# EasyEDA Pro project 无感无刷stc-V2.eprj

# Schematic Schematic1
Board Name: Board1; Create Date: 2025-03-20; Page Name: P1; Project Name: 无感无刷stc-V2; Schematic Name: Schematic1; Update Date: 2025-06-07; Company: 嘉立创EDA; Page Size: A4; Version: V1.0
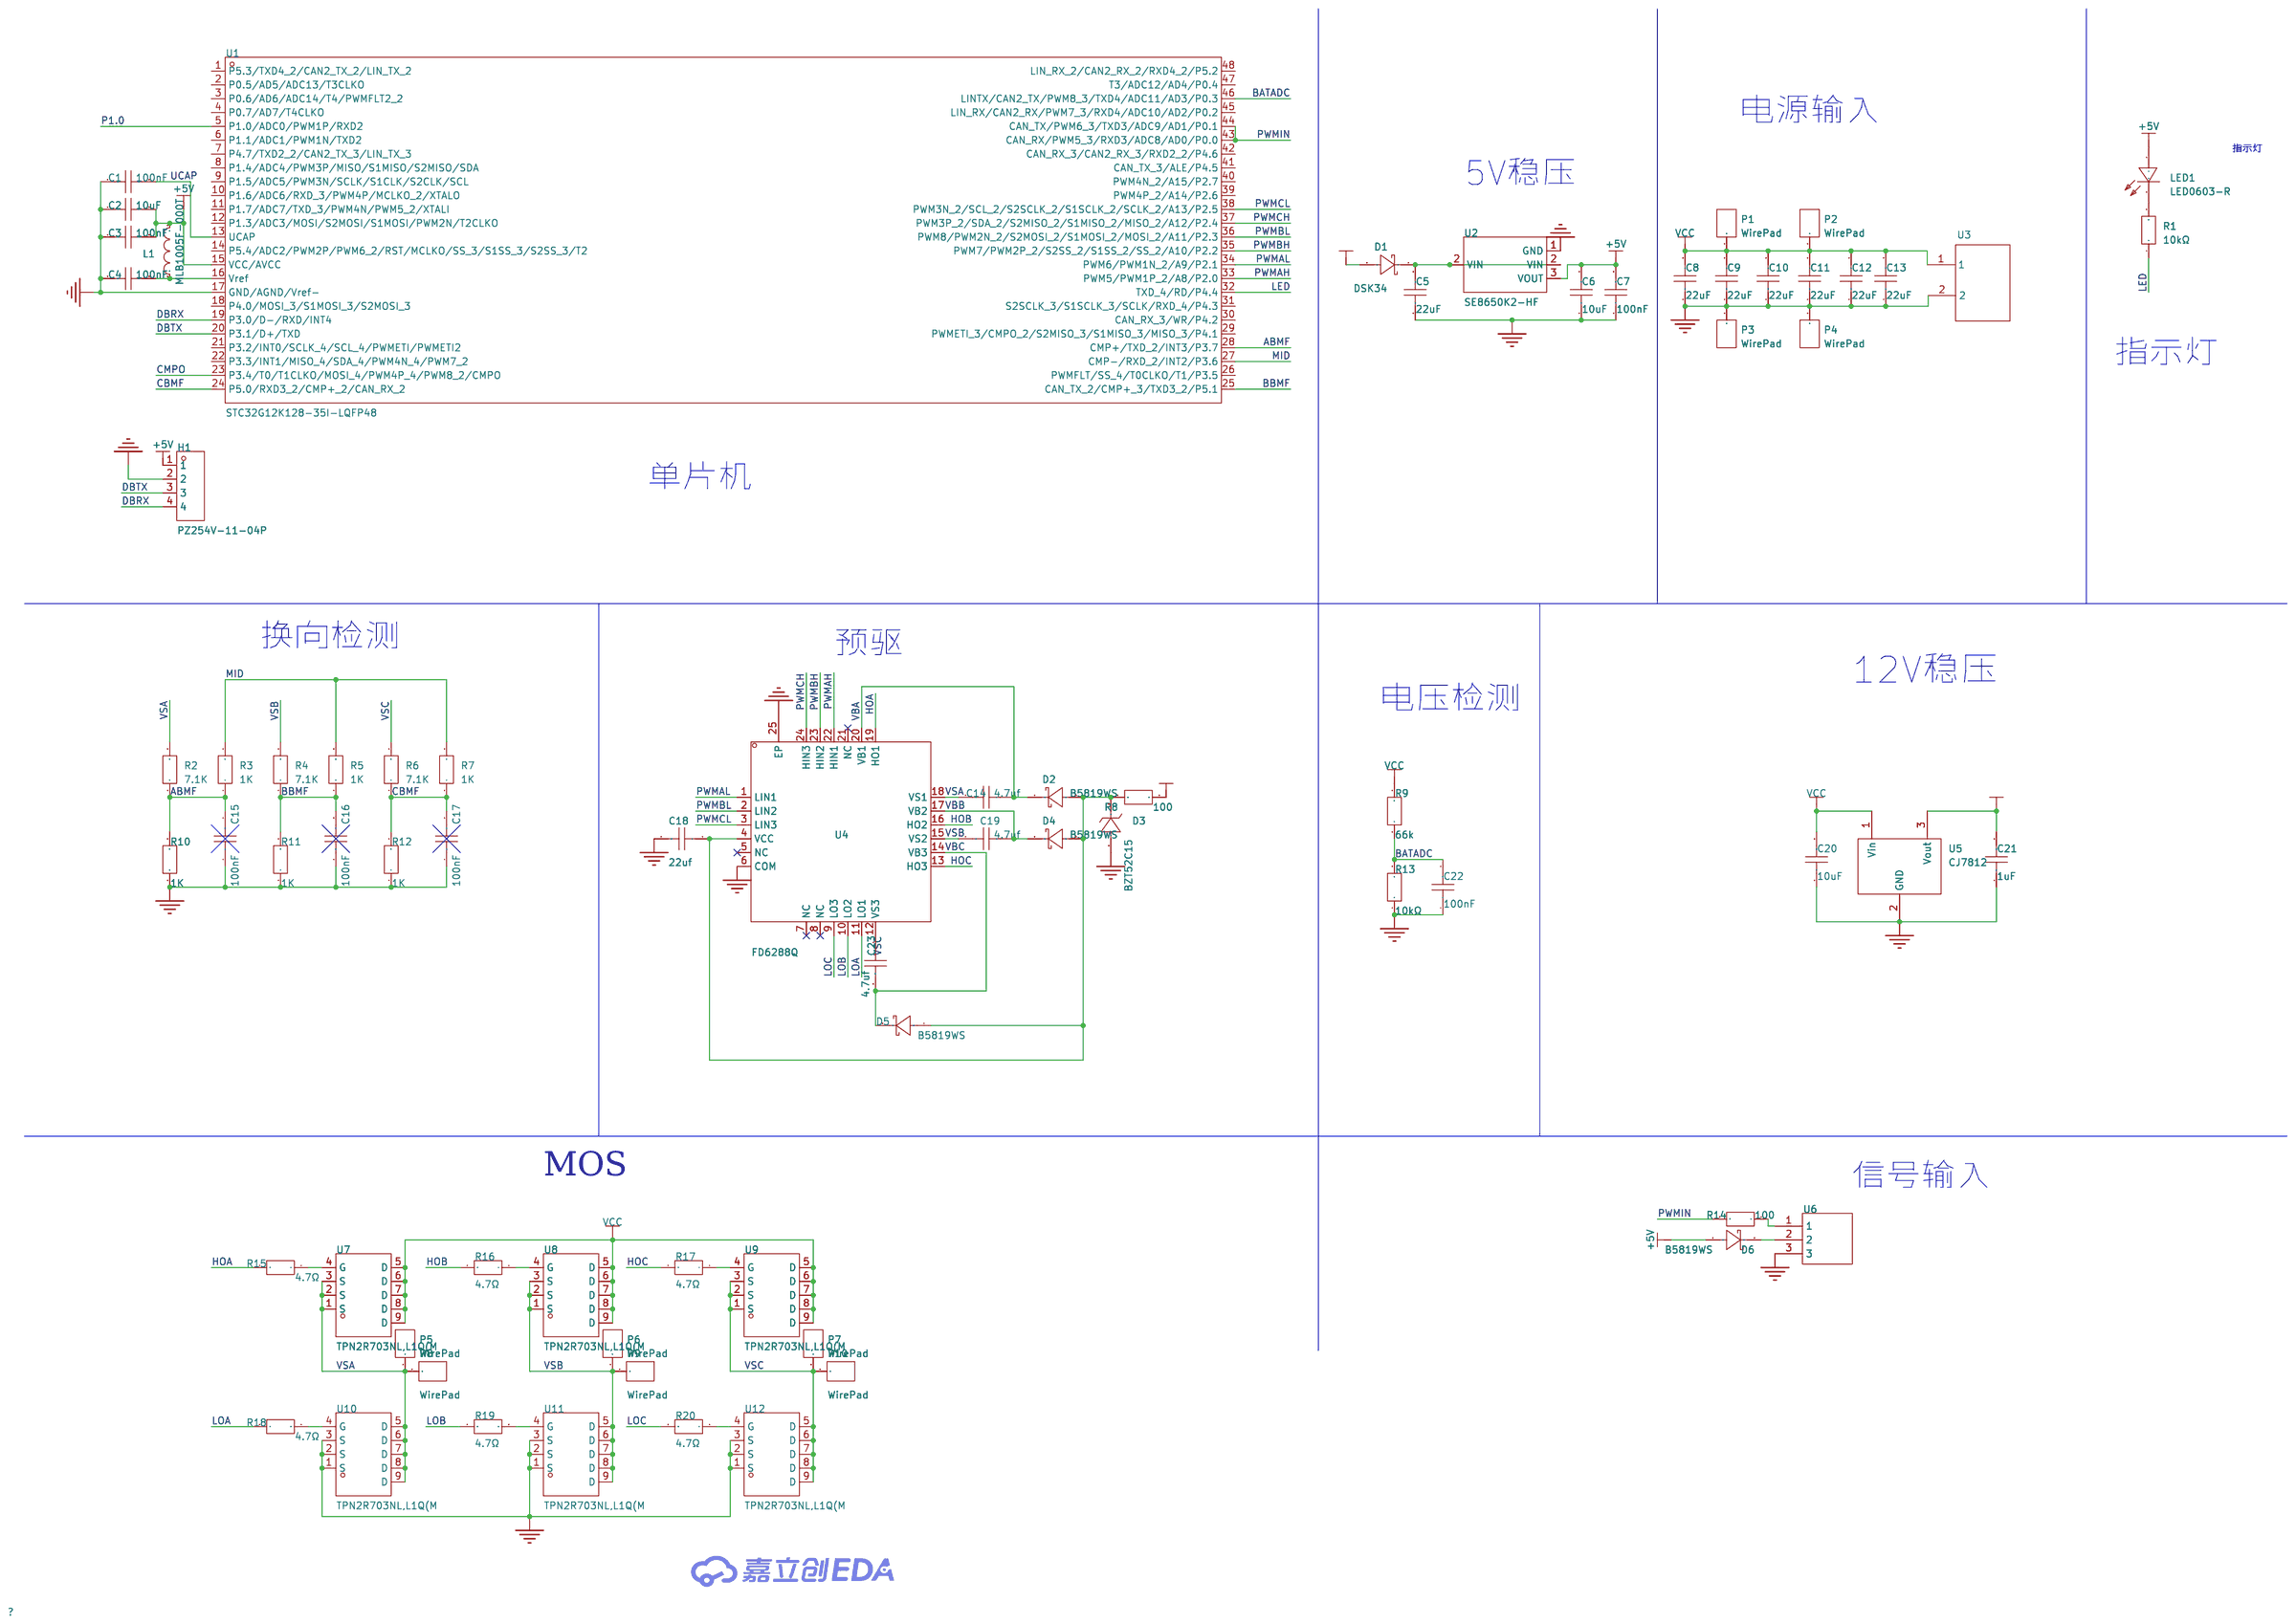
[diagram p0: schematic sheet]

## Parts
C1  100nF  [C0402]
C2  10uF  [C0603]
C3  100nF  [C0402]
C4  100nF  [C0402]
C5  22uF  [C0805]
C6  10uF  [C0603]
C7  100nF  [C0402]
C8  22uF  [C0805]
C9  22uF  [C0805]
C10  22uF  [C0805]
C11  22uF  [C0805]
C12  22uF  [C0805]
C13  22uF  [C0805]
C14  4.7uf  [C0603]
C15  100nF  [C0402]
C16  100nF  [C0402]
C17  100nF  [C0402]
C18  22uf  [C0805]
C19  4.7uf  [C0603]
C20  10uF  [C0603]
C21  1uF  [C0402]
C22  100nF  [C0402]
C23  4.7uf  [C0603]
D1  DSK34  [SOD-123FL_L2.7-W1.8-LS3.8-RD]
D2  B5819WS  [SOD-323_L1.7-W1.3-LS2.5-FD]
D3  BZT52C15  [SOD-123_L2.7-W1.6-LS3.7-RD]
D4  B5819WS  [SOD-323_L1.7-W1.3-LS2.5-FD]
D5  B5819WS  [SOD-323_L1.7-W1.3-LS2.5-FD]
D6  B5819WS  [SOD-323_L1.7-W1.3-LS2.5-FD]
H1  PZ254V-11-04P  [HDR-TH_4P-P2.54-V-M]
L1  MLB1005F-000T  [L0402]
LED1  LED0603-R  [LED0603-R-RD]
P1  WirePad  [WIREPAD-4X6]
P2  WirePad  [WIREPAD-4X6]
P3  WirePad  [WIREPAD-4X6]
P4  WirePad  [WIREPAD-4X6]
P5  WirePad  [WIREPAD-4X6]
P6  WirePad  [WIREPAD-4X6]
P7  WirePad  [WIREPAD-4X6]
P8  WirePad  [WIREPAD-4X6]
P9  WirePad  [WIREPAD-4X6]
P10  WirePad  [WIREPAD-4X6]
R1  10kΩ  [R0402]
R2  7.1K  [R0402]
R3  1K  [R0402]
R4  7.1K  [R0402]
R5  1K  [R0402]
R6  7.1K  [R0402]
R7  1K  [R0402]
R8  100  [R0402]
R9  66k  [R0402]
R10  1K  [R0402]
R11  1K  [R0402]
R12  1K  [R0402]
R13  10kΩ  [R0402]
R14  100  [R0402]
R15  4.7Ω  [R0402]
R16  4.7Ω  [R0402]
R17  4.7Ω  [R0402]
R18  4.7Ω  [R0402]
R19  4.7Ω  [R0402]
R20  4.7Ω  [R0402]
U1  STC32G12K128-35I-LQFP48  [LQFP-48_L7.0-W7.0-P0.50-LS9.0-BL]
U2  SE8650K2-HF  [SOT-89-3_L4.5-W2.5-P1.50-LS4.2-BR]
U3  -  [CAPPR5-8X12]
U4  FD6288Q  [QFN-24_L4.0-W4.0-P0.50-BL-EP2.6]
U5  CJ7812  [TO-252-3_L6.5-W5.8-P4.58-BL]
U6  -  [HDR1X3-TP]
U7  TPN2R703NL,L1Q(M  [TSON-8_L3.1-W3.1-P0.65-LS3.3-BL-EP]
U8  TPN2R703NL,L1Q(M  [TSON-8_L3.1-W3.1-P0.65-LS3.3-BL-EP]
U9  TPN2R703NL,L1Q(M  [TSON-8_L3.1-W3.1-P0.65-LS3.3-BL-EP]
U10  TPN2R703NL,L1Q(M  [TSON-8_L3.1-W3.1-P0.65-LS3.3-BL-EP]
U11  TPN2R703NL,L1Q(M  [TSON-8_L3.1-W3.1-P0.65-LS3.3-BL-EP]
U12  TPN2R703NL,L1Q(M  [TSON-8_L3.1-W3.1-P0.65-LS3.3-BL-EP]

## Library data of the parts
C1 C3 C4 C7 C14-C19 C21-C23 = CL05B104KB54PNC: LCSC Part Name: 100nF ±10% 50V; Supplier Part: C307331; Manufacturer: SAMSUNG(三星); Supplier Footprint: 0402; JLCPCB Part Class: 基础库; Datasheet: https://atta.szlcsc.com/upload/public/pdf/source/20160218/1457707763339.pdf; Supplier: LCSC; Tolerance: ±10%; Voltage Rated: 50V; Temperature Coefficient: X7R
C2 C5 C6 C8-C13 C20 = CGA0603X5R106K100JT: LCSC Part Name: 10uF ±10% 10V; Supplier Part: C6119842; Manufacturer: HRE(芯声); Supplier Footprint: 0603; JLCPCB Part Class: 扩展库; Supplier: LCSC; Tolerance: ±10%; Voltage Rating: 10V; Temperature Coefficient: X5R
D1 = DSK34_C7502709: LCSC Part Name: 电压:40V 电流:3A; Supplier Part: C7502709; Manufacturer: 宏迦橙; Supplier Footprint: SOD-123FL; Datasheet: https://atta.szlcsc.com/upload/public/pdf/source/20240814/5E8D2EAF2EE69BEF369BE6AC64F67CC4.pdf; Supplier: LCSC; Diode Configuration: 独立式; Forward Voltage (Vf@If): 550mV@3A; Reverse Voltage (Vr): 40V; Rectified Current: 3A; Reverse Leakage Current (Ir): 500uA
D2 D4-D6 = B5819WS_C7420331: LCSC Part Name: 电压:40V 电流:1A; Supplier Part: C7420331; Manufacturer: 宏迦橙; Supplier Footprint: SOD-323; JLCPCB Part Class: 扩展库; Datasheet: https://atta.szlcsc.com/upload/public/pdf/source/20230828/03CA0F4F90DAE368A7153B7B5E4D0651.pdf; Supplier: LCSC; Diode Configuration: 独立式; Forward Voltage (Vf@If): 600mV@1.0A; Reverse Voltage (Vr): 40V; Rectified Current: 1A; Reverse Leakage Current (Ir): 1mA@40V
D3 = BZT52C15_C19077412: Supplier Part: C19077412; Manufacturer: 宏嘉诚; Supplier Footprint: SOD-123; JLCPCB Part Class: 扩展库; Datasheet: https://atta.szlcsc.com/upload/public/pdf/source/20250106/E12AA82D484C9C66E469D005F460C1F7.pdf; Supplier: LCSC; Diode Configuration: 独立式; Zener Voltage(Nom): 15V; Reverse Leakage Current (Ir): 100nA@10.5V; Zener Voltage(Range): 14.25V~15.75V; Pd - Power Dissipation(Pd): 500mW; Impedance(Zzt): 40Ω
H1 = PZ254V-11-04P: LCSC Part Name: 间距:2.54mm 1x4P 直插 方针; Supplier Part: C2691448; Manufacturer: XFCN(兴飞); Supplier Footprint: 插件,P=2.54mm; JLCPCB Part Class: 扩展库; Datasheet: https://atta.szlcsc.com/upload/public/pdf/source/20200309/C492403_F9F19131791D08044AD4F84F8E751A34.pdf; Supplier: LCSC; Pin Structure: 1x4P; Pitch: 2.54mm; Circluar Pins/Square Pins: 方针; Mounting Type: 直插; Number of Rows: 单排; Number of Pins: 4P; Current Rating (Max): 3A; Voltage Rating (Max): 250V; Length of Mating Pin: 6mm; Insulation Height: 2.5mm; Length of End Connection Pin: 3mm; Operating Temperature Range: -40℃~+105℃; Color: 黑色
L1 = MLB1005F-000T: LCSC Part Name: 单路 0402磁珠 阻抗0Ω@100MHz; Supplier Part: C2844526; Manufacturer: MetalLions(美铼); Supplier Footprint: 0402; JLCPCB Part Class: 扩展库; Datasheet: https://atta.szlcsc.com/upload/public/pdf/source/20230602/7F9B6FFD64AF4C161BE293D8440B9AF6.pdf; Supplier: LCSC; Impedance @ Frequency: 0Ω@100MHz; Tolerance: ±25%; Number of Circuits: 1
LED1 = LED0603-R: Supplier Part: C9900005326; Supplier Footprint: LED0603; JLCPCB Part Class: 扩展库; Supplier: LCSC
P1-P10 = WirePad: Origin Footprint 2: WirePad-4.5x7
R1-R20 = RC0402DR-0747KL: LCSC Part Name: 厚膜电阻 47kΩ ±0.5% 62.5mW; Supplier Part: C723470; Manufacturer: YAGEO(国巨); Supplier Footprint: 0402; JLCPCB Part Class: 扩展库; Datasheet: https://atta.szlcsc.com/upload/public/pdf/source/20200814/C723470_5933CD9E9B30CAB1E2338017F3C74EA1.pdf; Supplier: LCSC; Type: 厚膜电阻; Tolerance: ±0.5%; Power(Watts): 62.5mW; Overload Voltage (Max): 50V; Temperature Coefficient: ±100ppm/℃; Operating Temperature Range: -55℃~+155℃
U1 = STC32G12K128-35I-LQFP48: Supplier Part: C5210760; Manufacturer: STC; Supplier Footprint: LQFP-48(7x7); JLCPCB Part Class: 扩展库; Datasheet: https://atta.szlcsc.com/upload/public/pdf/source/20241226/E8981118341CB9C62D3D58EFD7554832.pdf; Supplier: LCSC
U2 = SE8650K2-HF: LCSC Part Name: 输入80V 输出5V; Supplier Part: C496616; Manufacturer: SEAWARD(思旺); Supplier Footprint: SOT-89-3; Datasheet: https://atta.szlcsc.com/upload/public/pdf/source/20231204/E5912244F6D9E24D718D6BDA01187AC7.pdf; Supplier: LCSC; Output Type: 固定; Voltage - Supply: 80V; Output Voltage: 5V; standby current: 2uA; Features: 短路保护(SCP)；低ESR；热保护(TSD)；带使能; Output Configuration: 正极; Number of Outputs: 1
U3 = cap
U4 = FD6288Q: Supplier Part: C328453; Manufacturer: Fortior Tech(峰岹); Supplier Footprint: QFN-24-EP(4x4); JLCPCB Part Class: 扩展库; Datasheet: https://atta.szlcsc.com/upload/public/pdf/source/20241101/0E2856EB301EAFFED732065FB088D773.pdf; Supplier: LCSC
U5 = CJ7812_C26184: LCSC Part Name: 输入35V 输出12V 1.5A; Supplier Part: C26184; Manufacturer: CJ(江苏长电/长晶); Supplier Footprint: TO-252-2; JLCPCB Part Class: 扩展库; Datasheet: https://atta.szlcsc.com/upload/public/pdf/source/20180412/C26184_C7F45D4504ECDF2F14935BA96F015906.pdf; Supplier: LCSC; Output Type: 固定; Voltage - Supply: 35V; Output Voltage: 12V; Output Current: 1.5A; Voltage Dropout: 2V@(1A); Output Configuration: 正极; Number of Outputs: 1
U6 = 输入信号
U7-U12 = TPN2R703NL,L1Q(M: Supplier Part: C5307666; Manufacturer: TOSHIBA(东芝); Supplier Footprint: TSON-8; Datasheet: https://atta.szlcsc.com/upload/public/pdf/source/20221207/F3F28B90115C5E074AC0CD2ED28456D7.pdf; Supplier: LCSC; Type: 1个N沟道; Drain Source Voltage (Vdss): 30V; Drain Source On Resistance (RDS(on)@Vgs,Id): 3.3mΩ@4.5V,22.5A; Power Dissipation (Pd): 42W; Gate Threshold Voltage (Vgs(th)@Id): 1.3V@0.3mA; Input Capacitance (Ciss@Vds): 1.6nF@15V; Reverse Transfer Capacitance (Crss@Vds): 53pF@15V

## Nets
+5V: C2.2 C3.2 C6.2 C7.2 D6.1(A) H1.1 L1.2 LED1.1(A) U1.15(VCC/AVCC) U2.3(VOUT)
GND: C1.1 C2.1 C3.1 C4.1 C5.1 C6.1 C7.1 C8.1 C9.1 C10.1 C11.1 C12.1 C13.1 C15.1 C16.1 C17.1 C18.2 C20.1 C21.1 C22.1 D3.2(A) H1.2 P3.1 P4.1 R10.1 R11.1 R12.1 R13.1 U1.17(GND/AGND/Vref-) U2.1(GND) U3.2 U4.6(COM) U4.25(EP) U5.2(GND) U6.3 U10.1(S) U10.2(S) U10.3(S) U11.1(S) U11.2(S) U11.3(S) U12.1(S) U12.2(S) U12.3(S)
VCC: C8.2 C9.2 C10.2 C11.2 C12.2 C13.2 C20.2 P1.1 P2.1 R9.2 U3.1 U5.1(Vin) U7.5(D) U7.6(D) U7.7(D) U7.8(D) U7.9(D) U8.5(D) U8.6(D) U8.7(D) U8.8(D) U8.9(D) U9.5(D) U9.6(D) U9.7(D) U9.8(D) U9.9(D)
VCC12: C21.2 D1.2(A) R8.1 U5.3(Vout)
ABMF: C15.2 R2.1 R3.1 R10.2 U1.28(CMP+/TXD_2/INT3/P3.7)
BATADC: C22.2 R9.1 R13.2 U1.46(LINTX/CAN2_TX/PWM8_3/TXD4/ADC11/AD3/P0.3)
BBMF: C16.2 R4.1 R5.1 R11.2 U1.25(CAN_TX_2/CMP+_3/TXD3_2/P5.1)
CBMF: C17.2 R6.1 R7.1 R12.2 U1.24(P5.0/RXD3_2/CMP+_2/CAN_RX_2)
CMPO: U1.23(P3.4/T0/T1CLKO/MOSI_4/PWM4P_4/PWM8_2/CMPO)
DBRX: H1.4 U1.19(P3.0/D-/RXD/INT4)
DBTX: H1.3 U1.20(P3.1/D+/TXD)
HOA: R15.2 U4.19(HO1)
HOB: R16.2 U4.16(HO2)
HOC: R17.2 U4.13(HO3)
LED: R1.1 U1.32(TXD_4/RD/P4.4)
LOA: R18.2 U4.11(LO1)
LOB: R19.2 U4.10(LO2)
LOC: R20.2 U4.9(LO3)
MID: R3.2 R5.2 R7.2 U1.27(CMP-/RXD_2/INT2/P3.6)
P1.0: U1.5(P1.0/ADC0/PWM1P/RXD2)
PWMAH: U1.33(PWM5/PWM1P_2/A8/P2.0) U4.22(HIN1)
PWMAL: U1.34(PWM6/PWM1N_2/A9/P2.1) U4.1(LIN1)
PWMBH: U1.35(PWM7/PWM2P_2/S2SS_2/S1SS_2/SS_2/A10/P2.2) U4.23(HIN2)
PWMBL: U1.36(PWM8/PWM2N_2/S2MOSI_2/S1MOSI_2/MOSI_2/A11/P2.3) U4.2(LIN2)
PWMCH: U1.37(PWM3P_2/SDA_2/S2MISO_2/S1MISO_2/MISO_2/A12/P2.4) U4.24(HIN3)
PWMCL: U1.38(PWM3N_2/SCL_2/S2SCLK_2/S1SCLK_2/SCLK_2/A13/P2.5) U4.3(LIN3)
PWMIN: R14.2 U1.43(CAN_RX/PWM5_3/RXD3/ADC8/AD0/P0.0) U1.44(CAN_TX/PWM6_3/TXD3/ADC9/AD1/P0.1)
UCAP: C1.2 U1.13(UCAP)
VBA: C14.1 D2.2(K) U4.20(VB1)
VBB: C19.1 D4.2(K) U4.17(VB2)
VBC: C23.2 D5.2(K) U4.14(VB3)
VSA: C14.2 P5.1 P8.1 R2.2 U4.18(VS1) U7.1(S) U7.2(S) U7.3(S) U10.5(D) U10.6(D) U10.7(D) U10.8(D) U10.9(D)
VSB: C19.2 P6.1 P9.1 R4.2 U4.15(VS2) U8.1(S) U8.2(S) U8.3(S) U11.5(D) U11.6(D) U11.7(D) U11.8(D) U11.9(D)
VSC: C23.1 P7.1 P10.1 R6.2 U4.12(VS3) U9.1(S) U9.2(S) U9.3(S) U12.5(D) U12.6(D) U12.7(D) U12.8(D) U12.9(D)
$1N744: C4.2 L1.1 U1.16(Vref)
$1N1224: LED1.2(K) R1.2
$1N1370: R14.1 U6.1
$1N1446: D6.2(K) U6.2
$1N2821: C18.1 D2.1(A) D3.1(K) D4.1(A) D5.1(A) R8.2 U4.4(VCC)
$1N4610: C5.2 D1.1(K) U2.2(VIN)
$1N6905: R15.1 U7.4(G)
$1N6909: R18.1 U10.4(G)
$1N6914: R16.1 U8.4(G)
$1N6919: R19.1 U11.4(G)
$1N6924: R17.1 U9.4(G)
$1N6929: R20.1 U12.4(G)

Not connected (* = marked no-connect by the designer): U1 1(P5.3/TXD4_2/CAN2_TX_2/LIN_TX_2) 2(P0.5/AD5/ADC13/T3CLKO) 3(P0.6/AD6/ADC14/T4/PWMFLT2_2) 4(P0.7/AD7/T4CLKO) 6(P1.1/ADC1/PWM1N/TXD2) 7(P4.7/TXD2_2/CAN2_TX_3/LIN_TX_3) 8(P1.4/ADC4/PWM3P/MISO/S1MISO/S2MISO/SDA) 9(P1.5/ADC5/PWM3N/SCLK/S1CLK/S2CLK/SCL) 10(P1.6/ADC6/RXD_3/PWM4P/MCLKO_2/XTALO) 11(P1.7/ADC7/TXD_3/PWM4N/PWM5_2/XTALI) 12(P1.3/ADC3/MOSI/S2MOSI/S1MOSI/PWM2N/T2CLKO) 14(P5.4/ADC2/PWM2P/PWM6_2/RST/MCLKO/SS_3/S1SS_3/S2SS_3/T2) 18(P4.0/MOSI_3/S1MOSI_3/S2MOSI_3) 21(P3.2/INT0/SCLK_4/SCL_4/PWMETI/PWMETI2) 22(P3.3/INT1/MISO_4/SDA_4/PWM4N_4/PWM7_2) 26(PWMFLT/SS_4/T0CLKO/T1/P3.5) 29(PWMETI_3/CMPO_2/S2MISO_3/S1MISO_3/MISO_3/P4.1) 30(CAN_RX_3/WR/P4.2) 31(S2SCLK_3/S1SCLK_3/SCLK/RXD_4/P4.3) 39(PWM4P_2/A14/P2.6) 40(PWM4N_2/A15/P2.7) 41(CAN_TX_3/ALE/P4.5) 42(CAN_RX_3/CAN2_RX_3/RXD2_2/P4.6) 45(LIN_RX/CAN2_RX/PWM7_3/RXD4/ADC10/AD2/P0.2) 47(T3/ADC12/AD4/P0.4) 48(LIN_RX_2/CAN2_RX_2/RXD4_2/P5.2); U4 5(NC)* 7(NC)* 8(NC)* 21(NC)*

## Notes on the sheet
- 电源输入
- 指示灯
- 5V稳压
- 指示灯
- 单片机
- 换向检测
- 预驱
- 12V稳压
- 电压检测
- MOS
- 信号输入

# Board PCB1
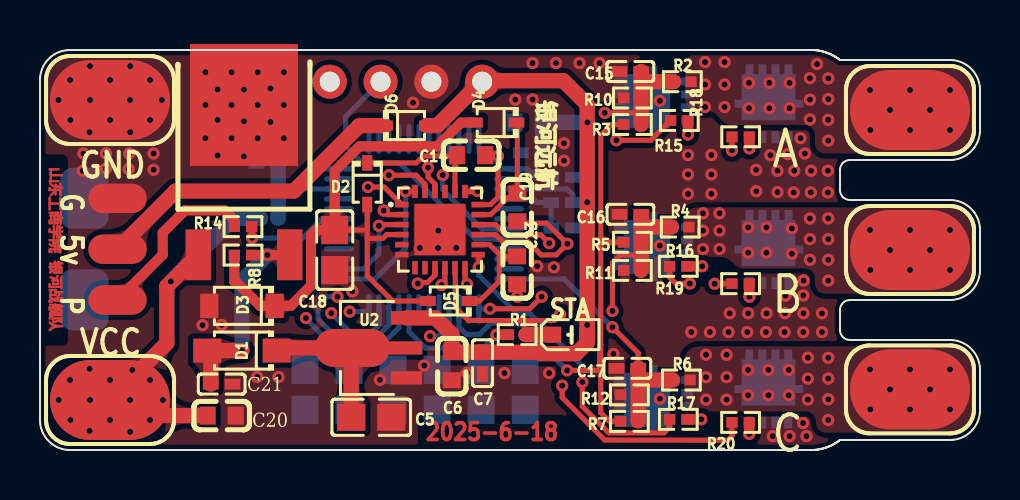
[diagram p1: board, top side]
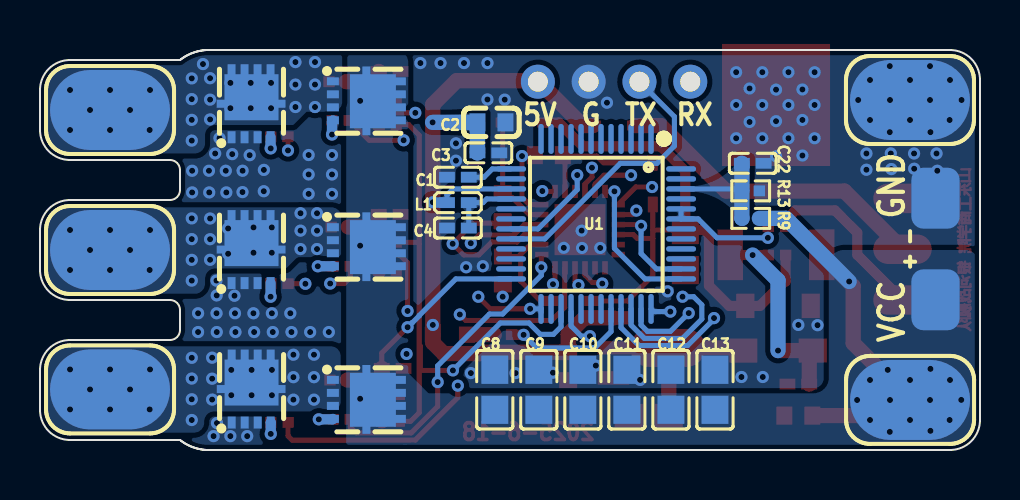
[diagram p2: board, bottom side, seen from below]

Outline 47 x 20 mm; copper layers: Top Layer, 内层1, Inner2, Bottom Layer. Coordinates in mm from the lower left corner of the outline.
Outline path: 0,18.5 arc(0.44,19.56) 1.5,20 38.68,20 38.71,20 38.74,20 38.77,19.99 38.83,19.99 38.89,19.98 38.91,19.97 38.94,19.97 39,19.96 39.06,19.94 39.09,19.94 39.14,19.92 39.17,19.92 39.2,19.91 39.26,19.89 39.31,19.87 39.34,19.86 39.39,19.84 39.42,19.83 39.47,19.81 39.5,19.8 39.55,19.78 39.6,19.75 39.68,19.71 39.73,19.68 39.78,19.65 39.83,19.62 39.86,19.6 39.88,19.59 39.93,19.55 39.95,19.54 40,19.5 45.5,19.5 arc(46.56,19.06) 47,18 47,16 arc(46.56,14.94) 45.5,14.5 40.5,14.5 arc(40.15,14.35) 40,14 40,13 arc(40.15,12.65) 40.5,12.5 45.5,12.5 arc(46.56,12.06) 47,11 47,9 arc(46.56,7.94) 45.5,7.5 40.5,7.5 arc(40.15,7.35) 40,7 40,6 arc(40.15,5.65) 40.5,5.5 45.5,5.5 arc(46.56,5.06) 47,4 47,2 arc(46.56,0.94) 45.5,0.5 40,0.5 39.95,0.46 39.93,0.45 39.88,0.41 39.86,0.4 39.81,0.36 39.78,0.35 39.73,0.32 39.68,0.29 39.6,0.25 39.55,0.22 39.5,0.2 39.47,0.19 39.42,0.17 39.39,0.16 39.34,0.14 39.28,0.12 39.26,0.11 39.2,0.09 39.17,0.08 39.14,0.08 39.09,0.06 39.06,0.06 39,0.04 38.94,0.03 38.91,0.03 38.89,0.02 38.83,0.01 38.77,0.01 38.74,0 38.71,0 38.68,0 1.5,0 arc(0.44,0.44) 0,1.5 0,18.5
Stack: Top Layer 0.035mm 外层铜厚1oz / Dielectric1 0.2104mm 7628 RC49% 8.6mil / 内层1 0.0152mm 内层铜厚 / Dielectric2 1.065mm 1.1mm H/HOZ Copper / Inner2 0.0152mm 内层铜厚 / Dielectric3 0.2104mm 7628 RC49% 8.6mil / Bottom Layer 0.035mm 外层铜厚1oz

## Design rules (mm)
template: 自用
spacing copperThickness1oz (default): track to track 0.102, other pairs 0.152 to 0.3
spacing copperThickness2oz: track to track 0.203, other pairs 0.152 to 0.3
track width copperThickness1oz (default): min 0.127, default 0.254, max 2.54
track width copperThickness2oz: min 0.203, default 0.254, max 2.54
track width Power_high: min 1.524, default 1.524, max 3.81
track width Power_low: min 0.762, default 0.762, max 2.54
differential pair differentialPair (default): width min 0.127, default 0.254, max 2.54; gap min 0.152, default 0.152
via viaSize (default): diameter min 0.5, default 0.61, max 10; hole min 0.3, default 0.305, max 6.299

## Placement (name value [footprint] x y rotation side)
C1  100nF  [C0402]  26.11 13.64 180 bottom
C2  10uF  [C0603]  24.43 16.38 0 bottom
C3  100nF  [C0402]  24.58 14.86 0 bottom
C4  100nF  [C0402]  26.11 11.1 180 bottom
C5  22uF  [C0805]  16.56 1.64 180 top
C6  10uF  [C0603]  20.59 4.19 90 top
C7  100nF  [C0402]  22.12 4.34 90 top
C8  22uF  [C0805]  24.26 3.01 270 bottom
C9  22uF  [C0805]  22.06 3.01 270 bottom
C10  22uF  [C0805]  19.86 3.01 270 bottom
C11  22uF  [C0805]  17.66 3.01 270 bottom
C12  22uF  [C0805]  15.45 3.01 270 bottom
C13  22uF  [C0805]  13.25 3.01 270 bottom
C14  4.7uf  [C0603]  21.56 14.74 0 top
C15  100nF  [C0402]  29.52 18.92 0 top
C16  100nF  [C0402]  29.52 11.78 0 top
C17  100nF  [C0402]  29.37 4.08 0 top
C18  22uf  [C0805]  14.73 10 270 top
C19  4.7uf  [C0603]  23.87 12.13 270 top
C20  10uF  [C0603]  9.08 1.72 180 top
C21  1uF  [C0402]  9.08 3.29 180 top
C22  100nF  [C0402]  11.36 14.33 0 bottom
C23  4.7uf  [C0603]  23.86 8.98 90 top
D1  DSK34  [SOD-123FL_L2.7-W1.8-LS3.8-RD]  10.1 4.97 180 top
D2  B5819WS  [SOD-323_L1.7-W1.3-LS2.5-FD]  16.36 13.31 90 top
D3  BZT52C15  [SOD-123_L2.7-W1.6-LS3.7-RD]  10.1 7.21 180 top
D4  B5819WS  [SOD-323_L1.7-W1.3-LS2.5-FD]  22.79 16.37 0 top
D5  B5819WS  [SOD-323_L1.7-W1.3-LS2.5-FD]  20.44 7.45 0 top
D6  B5819WS  [SOD-323_L1.7-W1.3-LS2.5-FD]  18.3 16.22 180 top
H1  PZ254V-11-04P  [HDR-TH_4P-P2.54-V-M]  18.3 18.42 180 top
L1  MLB1005F-000T  [L0402]  26.11 12.37 0 bottom
LED1  LED0603-R  [LED0603-R-RD]  26.51 5.77 0 top
P1  WirePad  [WIREPAD-4X6]  3.5 2.5 0 top
P2  WirePad  [WIREPAD-4X6]  3.5 2.5 180 bottom
P3  WirePad  [WIREPAD-4X6]  3.5 17.5 0 top
P4  WirePad  [WIREPAD-4X6]  3.5 17.5 180 bottom
P5  WirePad  [WIREPAD-4X6]  43.5 17 180 bottom
P6  WirePad  [WIREPAD-4X6]  43.5 10 180 bottom
P7  WirePad  [WIREPAD-4X6]  43.5 3.03 180 bottom
P8  WirePad  [WIREPAD-4X6]  43.5 17 0 top
P9  WirePad  [WIREPAD-4X6]  43.5 10 0 top
P10  WirePad  [WIREPAD-4X6]  43.5 3.03 0 top
R1  10kΩ  [R0402]  23.86 5.77 0 top
R2  7.1K  [R0402]  32.12 18.42 0 top
R3  1K  [R0402]  29.62 16.27 180 top
R4  7.1K  [R0402]  32.01 11.15 0 top
R5  1K  [R0402]  29.62 10.38 180 top
R6  7.1K  [R0402]  32.07 3.5 0 top
R7  1K  [R0402]  29.47 1.43 180 top
R8  100  [R0402]  10.15 9.75 180 top
R9  66k  [R0402]  11.46 11.58 180 bottom
R10  1K  [R0402]  29.62 17.6 0 top
R11  1K  [R0402]  29.62 8.98 0 top
R12  1K  [R0402]  29.47 2.76 0 top
R13  10kΩ  [R0402]  11.46 12.96 0 bottom
R14  100  [R0402]  10.15 11.17 0 top
R15  4.7Ω  [R0402]  31.97 16.48 180 top
R16  4.7Ω  [R0402]  31.91 9.18 180 top
R17  4.7Ω  [R0402]  31.91 1.53 180 top
R18  4.7Ω  [R0402]  35.03 15.66 180 top
R19  4.7Ω  [R0402]  35.03 8.32 180 top
R20  4.7Ω  [R0402]  35.03 1.38 180 top
U1  STC32G12K128-35I-LQFP48  [LQFP-48_L7.0-W7.0-P0.50-LS9.0-BL]  19.2 11.3 0 bottom
U2  SE8650K2-HF  [SOT-89-3_L4.5-W2.5-P1.50-LS4.2-BR]  16.97 5.1 0 top
U3  -  [CAPPR5-8X12]  2.22 10.05 90 bottom
U4  FD6288Q  [QFN-24_L4.0-W4.0-P0.50-BL-EP2.6]  20 11.02 270 top
U5  CJ7812  [TO-252-3_L6.5-W5.8-P4.58-BL]  10.2 13.5 0 top
U6  -  [HDR1X3-TP]  3.88 7.5 90 top
U7  TPN2R703NL,L1Q(M  [TSON-8_L3.1-W3.1-P0.65-LS3.3-BL-EP]  30.68 17.46 270 bottom
U8  TPN2R703NL,L1Q(M  [TSON-8_L3.1-W3.1-P0.65-LS3.3-BL-EP]  30.68 10.17 270 bottom
U9  TPN2R703NL,L1Q(M  [TSON-8_L3.1-W3.1-P0.65-LS3.3-BL-EP]  30.68 2.53 270 bottom
U10  TPN2R703NL,L1Q(M  [TSON-8_L3.1-W3.1-P0.65-LS3.3-BL-EP]  36.45 17.31 180 bottom
U11  TPN2R703NL,L1Q(M  [TSON-8_L3.1-W3.1-P0.65-LS3.3-BL-EP]  36.45 10.02 180 bottom
U12  TPN2R703NL,L1Q(M  [TSON-8_L3.1-W3.1-P0.65-LS3.3-BL-EP]  36.44 3.05 180 bottom

## Footprints (pads in the part's own frame, mm; a bottom-side part is the same pattern mirrored in y, then rotated)
C0402
  rect 0.79x0.54 smd: 1(-0.545,0) 2(0.545,0)
C0603
  rect 0.8x0.9 smd: 1(-0.7,0) 2(0.7,0)
C0805
  rect 1.41x1.35 smd: 1(-1,0) 2(1,0)
CAPPR5-8X12
  rrect 3.048x2.413 smd: 1(-2.54,0) 2(2.54,0)
HDR1X3-TP
  oval 1.473x2.921 smd: 1(0,0) 2(2.54,0) 3(5.08,0)
HDR-TH_4P-P2.54-V-M
  round 1.7 hole 1x0.305: 1(-3.81,0) 2(-1.27,0) 3(1.27,0) 4(3.81,0)
L0402
  rect 0.79x0.54 smd: 1(-0.545,0) 2(0.545,0)
LED0603-R-RD
  rect 0.8x0.8 smd: 1(0.851,0) 2(-0.851,0)
LQFP-48_L7.0-W7.0-P0.50-LS9.0-BL
  oval 0.27x1.5 smd: 1(-2.75,-4.25) 2(-2.25,-4.25) 3(-1.75,-4.25) 4(-1.25,-4.25) 5(-0.75,-4.25) 6(-0.25,-4.25) 7(0.25,-4.25) 8(0.75,-4.25) 9(1.25,-4.25) 10(1.75,-4.25) 11(2.25,-4.25) 12(2.75,-4.25) 25(2.75,4.25) 26(2.25,4.25) 27(1.75,4.25) 28(1.25,4.25) 29(0.75,4.25) 30(0.25,4.25) 31(-0.25,4.25) 32(-0.75,4.25) 33(-1.25,4.25) 34(-1.75,4.25) 35(-2.25,4.25) 36(-2.75,4.25)
  oval 1.5x0.27 smd: 13(4.25,-2.75) 14(4.25,-2.25) 15(4.25,-1.75) 16(4.25,-1.25) 17(4.25,-0.75) 18(4.25,-0.25) 19(4.25,0.25) 20(4.25,0.75) 21(4.25,1.25) 22(4.25,1.75) 23(4.25,2.25) 24(4.25,2.75) 37(-4.25,2.75) 38(-4.25,2.25) 39(-4.25,1.75) 40(-4.25,1.25) 41(-4.25,0.75) 42(-4.25,0.25) 43(-4.25,-0.25) 44(-4.25,-0.75) 45(-4.25,-1.25) 46(-4.25,-1.75) 47(-4.25,-2.25) 48(-4.25,-2.75)
QFN-24_L4.0-W4.0-P0.50-BL-EP2.6
  rect 0.28x0.665 smd: 1(-1.25,-1.907) 2(-0.75,-1.907) 3(-0.25,-1.907) 4(0.25,-1.907) 5(0.75,-1.907) 6(1.25,-1.907) 13(1.25,1.907) 14(0.75,1.907) 15(0.25,1.907) 16(-0.25,1.907) 17(-0.75,1.907) 18(-1.25,1.907)
  rect 0.665x0.28 smd: 7(1.907,-1.25) 8(1.907,-0.75) 9(1.907,-0.25) 10(1.907,0.25) 11(1.907,0.75) 12(1.907,1.25) 19(-1.907,1.25) 20(-1.907,0.75) 21(-1.907,0.25) 22(-1.907,-0.25) 23(-1.907,-0.75) 24(-1.907,-1.25)
  rect 2.55x2.55 smd: 25(0,0)
R0402
  rect 0.566x0.54 smd: 1(-0.433,0) 2(0.433,0)
SOD-123_L2.7-W1.6-LS3.7-RD
  rect 0.91x1.22 smd: 1(-1.635,0) 2(1.635,0)
SOD-123FL_L2.7-W1.8-LS3.8-RD
  rect 1.4x1.2 smd: 1(-1.735,0) 2(1.735,0)
SOD-323_L1.7-W1.3-LS2.5-FD
  rect 0.78x0.5 smd: 1(-1.04,0) 2(1.04,0)
SOT-89-3_L4.5-W2.5-P1.50-LS4.2-BR
  rect 1.575x0.672 smd: 1(1.356,-1.5) 3(1.356,1.5)
  custom 5.377x1.9 smd: 2(-1.356,0)
TO-252-3_L6.5-W5.8-P4.58-BL
  rect 1.27x2.54 smd: 1(-2.288,-3.747) 3(2.288,-3.745)
  rect 5.4x6.1 smd: 2(-0.002,3.747)
TSON-8_L3.1-W3.1-P0.65-LS3.3-BL-EP
  rect 0.4x0.6 smd: 1(-0.975,-1.675) 2(-0.325,-1.675) 3(0.325,-1.675) 4(0.975,-1.675) 5(0.975,1.675) 6(0.325,1.675) 7(-0.325,1.675) 8(-0.975,1.675)
  rect 0.6x0.4 smd: 9(-1.42,0) 9(1.42,0)
  rect 2.7x2.3 smd: 9(0.02,0.325)
WIREPAD-4X6
  rrect 6x4 smd: 1(0,0)

## Nets
As in the schematic.

Pads without a net: U1 1 2 3 4 6 7 8 9 10 11 12 14 18 21 22 26 29 30 31 39 40 41 42 45 47 48; U4 5 7 8 21

## Via types
v1: diameter 0.61, hole 0.305, Top Layer to Bottom Layer, 256 vias

## Routing (per net, layer and track width the routed paths; a pad name or vN(x,y) marks a point on that pad's centre or on a via; arc(x,y) is an arc through that point)
+5V: length 40.1
  Top Layer w0.762: D6.1 19.86,16.22 22.06,18.42 ; 22.06,18.42 22.11,18.47 26.17,18.47 27.36,17.28 v1(27.36,12.39) v1(27.36,6.25) LED1.1 27.36,5.36 26.81,4.82 25.03,4.82 24.97,4.89 C7.2 22.12,4.89 C6.2 20.59,5.79 19.78,6.6 U2.3 ; 22.06,18.42 H1.1
  Bottom Layer w0.254: L1.2 26.65,12.75 26.35,13.05 U1.15
  Bottom Layer w0.508: L1.2 27.34,12.37 v1(27.36,12.39)
  Bottom Layer w0.762: C3.2 25.13,14.86 C2.2 v1(27.37,16.38)
GND:
  vias: v1(0.92,17.5) v1(1.5,18.5) v1(1.52,16.5) v1(2.14,13.96) v1(2.17,14.83) v1(2.5,19.19) v1(2.5,17.5) v1(2.48,15.89) v1(3.3,14.83) v1(3.29,14.06) v1(3.5,18.5) v1(3.5,16.5) v1(4.43,14.05) v1(4.51,19.19) v1(4.5,17.5) v1(4.51,15.89) v1(4.46,14.83) v1(5.5,18.5) v1(5.5,16.5) v1(5.68,14.83) v1(5.68,14.01) v1(6.09,17.5) v1(8.12,6.24) v1(8.27,18.89) v1(8.27,17.25) v1(8.27,15.59) v1(8.88,18.03) v1(8.88,16.5) v1(8.88,14.72) v1(9.08,6.25) v1(9.58,18.89) v1(9.58,17.25) v1(9.58,15.59) v1(10.2,18.02) v1(10.2,16.44) v1(10.19,14.68) v1(10.88,18.89) v1(10.88,17.25) v1(10.88,15.59) v1(10.86,3.65) v1(11.52,18.08) v1(11.52,16.4) v1(11.93,3.65) v1(12.19,18.89) v1(12.19,17.25) v1(12.19,15.59) v1(15.62,7.93) v1(17,3.5) v1(18.65,17.36) v1(18.99,10.1) v1(19.21,4.22) v1(19.92,10.97) v1(19.9,10.1) v1(20.81,10.11) v1(21.35,3.86) v1(23.22,3.85) v1(23.76,17.52) v1(24.63,19.35) v1(24.63,17.53) v1(24.86,9.19) v1(25.46,3.85) v1(25.69,9.14) v1(25.8,19.35) v1(26.2,15.33) v1(26.2,14.47) v1(26.97,19.35) v1(27.98,19.35) v1(28.67,4.8) v1(32.4,14.75) v1(32.4,13.78) v1(32.4,12.81) v1(32.56,5.9) v1(33.49,5.9) v1(33.57,14.75) v1(33.57,13.78) v1(33.57,12.81) v1(34.43,5.9) v1(34.48,6.84) v1(35.41,6.84) v1(35.36,5.9) v1(35.81,14.01) v1(35.81,12.94) v1(36.33,6.84) v1(36.29,5.9) v1(36.52,14.74) v1(36.64,0.69) v1(36.87,13.96) v1(36.88,12.9) v1(37.23,5.9) v1(37.28,7.71) v1(37.25,6.84) v1(37.39,14.79) v1(37.48,0.69) v1(37.71,13.96) v1(37.68,12.88) v1(38.03,15.59) v1(38.24,14.83) v1(38.18,8.47) v1(38.16,7.73) v1(38.17,6.84) v1(38.16,5.9) v1(38.15,1.35) v1(38.32,0.69) v1(38.54,12.88) v1(38.55,13.96) v1(39.1,6.84) v1(39.1,5.9) v1(39.39,13.96) v1(39.39,12.88)
VCC: length 20.1
  Top Layer w0.762: C20.2 4.28,1.72 P1.1 6.34,5.34 6.34,8.19 U5.1
  Bottom Layer w0.762: R9.2 9.7,11.58 v1(6.54,8.42)
  vias: v1(0.94,2.5) v1(1.5,3.5) v1(1.52,1.5) v1(2.48,4.06) v1(2.5,2.5) v1(2.48,0.96) v1(3.5,3.5) v1(3.5,1.5) v1(4.5,2.5) v1(4.51,0.91) v1(4.61,4.01) v1(5.5,3.5) v1(5.5,1.5) v1(6.14,2.5) v1(30.99,17.46) v1(30.99,10.22) v1(30.99,2.56)
VCC12: length 10.7
  Top Layer w0.508: R8.1 v1(11.37,9.75) 12.47,9.75 U5.3
  Top Layer w0.762: v1(10.1,4.97) D1.2 8.54,4.8 C21.2
  Bottom Layer w0.762: v1(10.1,4.97) 10.1,8.48 v1(11.37,9.75)
ABMF: length 27
  Top Layer w0.254: 30.05,16.86 30.05,16.86 v1(28.23,16.86)
  Top Layer w0.762: C15.2 30.05,18.91 30.05,18.42 ; R3.1 R10.2 30.05,18.42 ; 30.05,18.42 30.06,18.42 R2.1
  内层1 w0.254: v1(28.23,16.86) 28.23,14.96 26.8,13.53 21.35,13.53 18.23,10.41 18.23,6.97 v1(19.51,5.69)
  Bottom Layer w0.254: v1(19.51,5.69) 19.94,5.69 20.45,6.2 20.45,6.9
BATADC: length 5.8
  Bottom Layer w0.254: R13.2 11.91,12.97 11.99,13.05 U1.46
  Bottom Layer w0.762: C22.2 11.91,11.59 R9.1
BBMF: length 15.6
  Top Layer w0.254: v1(28.62,6.95) 28.62,9.36 29,9.75 30.02,9.75 30.05,9.71 ; v1(25.08,7.66) 24.48,7.06 v1(22.49,7.06) ; 30.05,11.77 C16.2
  Top Layer w0.762: 30.05,11.16 R5.1 R11.2 ; 30.05,11.16 30.07,11.15 R4.1 ; 30.05,11.16 30.05,11.67
  内层1 w0.254: v1(28.62,6.95) 26.71,6.95 26,7.66 v1(25.08,7.66)
  Bottom Layer w0.254: 21.95,6.9 21.95,7.06 v1(22.49,7.06)
CBMF: length 13.1
  Top Layer w0.254: v1(28.62,6.14) 29.91,4.85 29.91,4.16
  Top Layer w0.762: 29.91,3.55 29.91,1.48 29.9,1.47 ; 29.91,3.55 C17.2 ; 29.91,3.55 29.96,3.5 31.64,3.5
  Bottom Layer w0.254: U1.24 26.21,8.55 28.04,6.72 28.04,6.71 28.38,6.37 28.39,6.37 v1(28.62,6.14)
DBRX: length 12.8
  内层1 w0.254: H1.4 18.03,14.88 19.7,14.88 20.14,14.44 v1(20.14,13.75)
  Bottom Layer w0.254: U1.19 22.1,11.05 20.14,13.02 v1(20.14,13.75)
DBTX: length 14
  Bottom Layer w0.254: H1.3 15.28,16.67 15.28,15.2 16.15,14.33 17.98,14.33 21.76,10.55 U1.20
HOA: length 12.2
  Top Layer w0.254: U4.19 21.87,12.93 v1(21.88,12.95) ; v1(28.82,15.49) 30.54,15.49 R15.2
  内层1 w0.254: v1(28.82,15.49) 28.82,14.8 26.96,12.95 v1(21.88,12.95)
HOB: length 13.5
  Top Layer w0.254: v1(25.46,10.34) 25.05,10.75 23.3,10.75 22.78,11.27 U4.16 ; R16.2 31.48,8.63 31.79,8.32 v1(32.49,8.32)
  内层1 w0.254: v1(25.46,10.34) 27.48,8.32 v1(32.49,8.32)
HOC: length 15.6
  Top Layer w0.254: v1(21.94,9.14) 21.94,9.74 U4.13 ; R17.2 31.48,1.14 31.2,0.86 28.44,0.86 27.12,2.18 v1(27.12,3.4)
  Bottom Layer w0.254: v1(21.94,9.14) 21.94,8.73 23.87,6.8 24.53,6.8 27.12,4.21 v1(27.12,3.4)
LED: length 6.7
  Top Layer w0.508: R1.1 23.41,5.76 v1(22.82,5.76)
  Bottom Layer w0.254: v1(22.82,5.76) 22.16,5.1 19.33,5.1 19.33,5.11 19.26,5.11 18.45,5.92 U1.32
LOA: length 25.4
  Top Layer w0.254: R18.2 v1(34.6,14.98) ; U4.11 20.77,9.09 20.77,7.13 21.42,6.48 25.71,6.48 v1(26.01,6.78)
  内层1 w0.254: v1(26.01,6.78) 27.31,5.48 29.1,5.48 30.62,7 33.52,7 34.6,8.09 v1(34.6,14.98)
LOB: length 17.3
  Top Layer w0.254: U4.10 20.25,8.42 v1(20.08,8.25) ; R19.2 33.74,8.32 v1(33.73,8.31)
  内层1 w0.254: v1(33.73,8.31) 32.96,7.54 27.09,7.54 26.28,8.35 24.12,8.35 22.75,9.72 21.55,9.72 v1(20.08,8.25)
LOC: length 22.3
  Top Layer w0.254: R20.2 34.6,0.7 34.39,0.49 28.24,0.5 26.11,2.63 v1(26.11,3.22) ; v1(18.89,8.32) 18.94,8.37 19.38,8.37 19.75,8.75 U4.9
  内层1 w0.254: v1(26.11,3.22) 25.16,3.22 23.97,4.41 23.97,5.78 23.27,6.48 20.73,6.48 v1(18.89,8.32)
MID: length 28
  Top Layer w0.254: R3.2 28.57,16.27 28.04,15.74 28.04,10.3 ; 28.04,5.25 28.04,1.87 28.47,1.43 R7.2 ; 28.04,5.25 27.98,5.19 27.98,3.98 v1(26.35,3.98) ; 28.04,5.25 28.04,10.3 ; 28.04,10.3 28.13,10.38 R5.2
  Bottom Layer w0.254: 20.95,6.9 20.95,6.16 21.33,5.78 21.99,5.78 22.55,6.35 23.98,6.35 v1(26.35,3.98)
PWMAH: length 20.7
  Top Layer w0.254: U4.22 19.75,13.3 19.4,13.64 v1(19.4,14.11)
  内层1 w0.254: v1(13.3,6.6) 13.3,12.49 15.13,14.33 19.19,14.33 v1(19.4,14.11)
  Bottom Layer w0.254: U1.33 17.95,6.12 17.05,5.22 14.62,5.22 13.3,6.55 v1(13.3,6.6)
PWMAL: length 15
  Top Layer w0.254: U4.1 17.21,13.15 v1(16.4,13.15)
  内层1 w0.254: v1(14.87,7.66) 14.87,11.63 v1(16.4,13.15)
  Bottom Layer w0.254: U1.34 17.45,6.25 16.78,5.58 14.88,5.58 13.91,6.55 13.91,7.26 14.31,7.66 v1(14.87,7.66)
PWMBH: length 15.3
  Top Layer w0.254: U4.23 19.25,13.3 18.8,13.74 v1(17.45,13.74)
  内层1 w0.254: v1(17.45,13.74) 17.44,13.73 16.16,13.73 14.11,11.68 14.11,7.3 v1(14.56,6.84)
  Bottom Layer w0.254: U1.35 16.95,6.25 16.63,5.94 15.47,5.94 v1(14.56,6.84)
PWMBL: length 8.3
  Top Layer w0.254: U4.2 17.38,11.77 v1(17.18,11.97)
  内层1 w0.254: v1(15.48,6.92) 17.77,9.21 17.77,11.39 v1(17.18,11.97)
  Bottom Layer w0.254: v1(15.48,6.92) 16.31,6.92 U1.36
PWMCH: length 7.3
  Top Layer w0.254: U4.24 18.74,12.93 v1(18.28,12.93)
  Bottom Layer w0.254: U1.37 16.75,8.55 18.28,10.08 v1(18.28,12.93)
PWMCL: length 4.9
  Top Layer w0.254: U4.3 17.01,11.27 v1(16.94,11.21)
  Bottom Layer w0.254: U1.38 16.18,9.05 16.94,9.82 v1(16.94,11.21)
PWMIN: length 5.8
  Top Layer w0.254: R14.2 10.61,11.14 v1(10.61,10.61)
  Bottom Layer w0.254: v1(10.61,10.61) 13.15,10.61 14.09,11.55 U1.43 U1.44
UCAP: length 2.3
  Bottom Layer w0.254: C1.2 24.8,13.64 24.38,14.05 U1.13
VBA: length 6.5
  Top Layer w0.254: 20.82,14.7 20.75,14.63 U4.20 ; 20.82,14.7 19.16,14.7 18.82,14.36 D2.2 ; 20.82,14.7 C14.1
VBB: length 6.1
  Top Layer w0.254: D4.2 23.87,16.33 23.87,12.63 23.4,12.63 22.54,11.77 U4.17
VBC: length 5.4
  Top Layer w0.254: 22.97,9.78 22.97,8.44 21.98,7.45 D5.2 ; 22.97,9.78 23.07,9.68 C23.2 ; 22.97,9.78 22.48,10.27 U4.14
VSA: length 15.7
  Top Layer w0.254: U4.18 22.53,12.27 22.9,12.64 v1(22.9,14.7) 22.86,14.74 C14.2
  内层1 w0.254: v1(33.25,18.27) 26.48,18.27 v1(22.9,14.7)
  vias: v1(33.25,19.4) v1(33.25,17.15) v1(34.23,19.4) v1(34.23,18.27) v1(34.23,17.15) v1(35.45,18.36) v1(35.45,17.09) v1(36.46,18.36) v1(36.46,17.09) v1(37.48,18.36) v1(37.48,17.09) v1(38.5,18.59) v1(38.5,17.52) v1(38.5,16.53) v1(38.85,19.3) v1(39.41,18.58) v1(39.41,17.54) v1(39.41,16.51) v1(39.41,15.47) v1(41.5,18) v1(41.52,16) v1(42.5,17) v1(43.5,18) v1(43.5,16) v1(44.5,17) v1(45.5,18) v1(45.5,16)
VSB: length 15.1
  Top Layer w0.254: U4.15 22.78,10.77 23.15,10.4 24.41,10.4 25.06,9.76 25.81,9.76 v1(26.37,10.31) 25.33,11.34 23.86,11.34
  内层1 w0.254: v1(33.15,10.97) 27.02,10.97 v1(26.37,10.31)
  vias: v1(33.15,11.84) v1(33.15,10.05) v1(33.97,11.84) v1(33.97,10.97) v1(33.97,10.05) v1(35.41,11.13) v1(35.41,9.86) v1(36.32,11.13) v1(36.32,9.86) v1(37.59,11.08) v1(37.59,9.81) v1(38.5,11.58) v1(38.5,10.54) v1(38.5,9.51) v1(39.41,11.58) v1(39.41,10.54) v1(39.41,9.51) v1(39.41,8.47) v1(41.5,11) v1(41.52,9) v1(42.5,10) v1(43.5,11) v1(43.5,9) v1(44.5,10) v1(45.5,11) v1(45.5,9)
VSC: length 15.6
  Top Layer w0.254: v1(23.87,7.66) 23.86,7.67 23.86,8.49 ; v1(21.35,8.29) 21.25,8.39 U4.12
  内层1 w0.254: v1(21.35,8.29) 23.24,8.29 v1(23.87,7.66) 27.89,3.64 v1(33.3,3.64)
  vias: v1(33.3,4.77) v1(33.3,2.52) v1(34.33,4.77) v1(34.33,3.64) v1(34.33,2.52) v1(35.4,4) v1(35.4,2.74) v1(36.42,4) v1(36.42,2.74) v1(37.44,4) v1(37.44,2.74) v1(38.39,4.61) v1(38.39,3.57) v1(38.39,2.52) v1(39.41,4.61) v1(39.41,3.57) v1(39.41,2.54) v1(39.41,1.5) v1(41.5,4.03) v1(41.52,2.03) v1(42.5,3.03) v1(43.5,4.03) v1(43.5,2.03) v1(44.5,3.03) v1(45.5,4.03) v1(45.5,2.03)
$1N744: length 3.5
  Bottom Layer w0.254: U1.16 24.66,12.55 24.85,12.37 L1.1 C4.2
$1N1224: length 1.4
  Top Layer w0.762: R1.2 LED1.2
$1N1370: length 8.9
  Top Layer w0.508: R14.1 9.72,11.5 9.23,11.98 7.25,11.98 6.14,10.86 6.14,9.76 U6.1
$1N1446: length 15.9
  Top Layer w0.762: D6.2 15.97,16.22 12.7,12.95 6.78,12.95 U6.2
$1N2821: length 31.4
  Top Layer w0.254: 16.36,11.01 16.36,10.58 ; 16.36,11.01 16.34,11 C18.1 ; 16.36,11.01 16.36,12.28 ; 16.36,10.58 16.36,8.72 17.63,7.45 D5.1 ; 16.36,10.58 17.14,10.58 17.33,10.77 U4.4
  Top Layer w0.508: R8.2 9.72,8.43 9.78,8.43 11,7.21 D3.1 12.54,7.21 13.55,8.22 13.55,10.76 13.79,11 C18.1 14.73,13.94 15.97,15.18 19.85,15.18 20.16,15.48 20.17,15.48 21.06,16.37 D4.1
$1N4610: length 7.3
  Top Layer w0.762: 15.56,1.64 15.56,5.05 15.62,5.1 11.97,5.1 D1.1
$1N6905: length 1.4
  Top Layer w0.254: 32.4,16.32 R15.1
  Top Layer w0.508: v1(32.4,15.77) 32.4,16.32
  Bottom Layer w0.508: U7.4 32.4,16.44 v1(32.4,15.77)
$1N6909: length 1.1
  Top Layer w0.508: R18.1 v1(35.47,15.08)
  Bottom Layer w0.508: U10.4 35.47,15.08 v1(35.47,15.08)
$1N6914: length 1.5
  Top Layer w0.508: 32.35,9.18 32.35,9.19 v1(33.11,9.19)
  Bottom Layer w0.508: U8.4 32.36,9.19 v1(33.11,9.19)
$1N6919: length 1.5
  Top Layer w0.254: 35.36,8.32 35.41,8.27 35.45,8.23
  Top Layer w0.508: v1(35.47,7.66) 35.46,7.67 R19.1
  Bottom Layer w0.508: U11.4 v1(35.47,7.66)
$1N6924: length 1.4
  Top Layer w0.508: R17.1 v1(33.06,1.53)
  Bottom Layer w0.508: U9.4 32.38,1.53 v1(33.06,1.53)
$1N6929: length 1.1
  Top Layer w0.508: R20.1 v1(35.46,0.81)
  Bottom Layer w0.508: v1(35.46,0.81) 35.46,1.37 U12.4

## Copper pours and planes (outline as drawn; the poured copper is in the pictures)
GND on Top Layer: -1.79,24.83 51.09,24.83 51.09,-7.12 -1.79,-7.12
GND on Bottom Layer: -1.79,24.58 51.09,24.58 51.09,-7.48 -1.79,-7.48
GND on 内层1: -2.86,22.5 49.21,22.5 49.21,-3.26 -2.86,-3.26
GND on Inner2: 0.26,19.74 46.74,19.74 46.74,0.26 0.26,0.26
VCC on Bottom Layer: 28.59,19.35 28.61,19.5 28.66,19.67 28.75,19.82 28.88,19.94 29.03,20.04 29.2,20.09 29.35,20.11 30.93,20.11 31.08,20.09 31.25,20.04 31.4,19.94 31.52,19.82 31.62,19.67 31.67,19.5 31.69,19.35 31.69,0.4 31.67,0.24 31.62,0.08 31.52,-0.08 31.4,-0.2 31.25,-0.29 31.08,-0.35 30.93,-0.36 29.35,-0.36 29.2,-0.35 29.03,-0.29 28.88,-0.2 28.75,-0.08 28.66,0.08 28.61,0.24 28.59,0.4
VCC on Bottom Layer: 27.37,4.08 29.35,4.08 29.35,2.2 27.37,2.2
VCC on Bottom Layer: 0,9.24 0.22,9.78 0.76,10 6.8,10 7.34,9.78 7.56,9.24 7.56,3.6 7.78,3.06 8.32,2.84 28.27,2.84 28.81,2.61 29.03,2.08 29.03,0.76 28.81,0.22 28.27,0 0.76,0 0.22,0.22 0,0.76
VSA on Bottom Layer: 33.67,16.91 32.4,16.91 32.04,17.06 31.89,17.42 31.89,20.47 32.04,20.62 36.05,20.62 36.24,20.58 36.41,20.47 36.42,20.46 36.58,20.35 36.78,20.31 46.21,20.31 46.4,20.27 46.57,20.16 47.39,19.34 47.5,19.18 47.54,18.98 47.54,15.08 47.28,14.83 39.26,14.83 38.9,14.97 38.75,15.33 38.75,15.74 38.6,16.1 38.24,16.25 34.33,16.25
VSA on 内层1: 33.67,16.91 32.4,16.91 32.04,17.06 31.89,17.42 31.89,20.47 32.04,20.62 36.05,20.62 36.24,20.58 36.41,20.47 36.42,20.46 36.58,20.35 36.78,20.31 46.21,20.31 46.4,20.27 46.57,20.16 47.39,19.34 47.5,19.18 47.54,18.98 47.54,15.08 47.28,14.83 39.26,14.83 38.9,14.97 38.75,15.33 38.75,15.74 38.6,16.1 38.24,16.25 34.33,16.25
VSB on Top Layer: 46.88,12.13 47.24,11.98 47.39,11.63 47.39,8.32 47.24,7.96 46.88,7.82 39.26,7.82 38.9,7.96 38.75,8.32 38.75,8.57 38.6,8.93 38.24,9.08 35.23,9.08 34.95,9.13 34.71,9.28 34.54,9.44 34.3,9.59 34.02,9.64 32.89,9.64 32.35,9.87 32.13,10.41 32.13,11.37 32.35,11.91 32.89,12.13
VSB on Bottom Layer: 34.2,9.57 34.12,9.63 34.02,9.64 32.18,9.64 32,9.72 31.92,9.9 31.92,11.63 32.07,11.98 32.43,12.13 46.88,12.13 47.24,11.98 47.39,11.63 47.39,8.32 47.24,7.96 46.88,7.82 39.26,7.82 38.9,7.96 38.75,8.32 38.75,8.57 38.6,8.93 38.24,9.08 34.8,9.08 34.7,9.1 34.62,9.15
VSB on 内层1: 31.92,9.64 31.92,11.63 32.07,11.98 32.43,12.13 46.88,12.13 47.24,11.98 47.39,11.63 47.39,8.32 47.24,7.96 46.88,7.82 39.26,7.82 38.9,7.96 38.75,8.32 38.75,8.57 38.6,8.93 38.24,9.08 34.93,9.08 34.32,9.64
VSC on Top Layer: 32.2,4.43 32.42,4.96 32.96,5.19 46.92,5.19 47.28,5.04 47.43,4.68 47.43,1.38 47.28,1.02 46.92,0.87 39.3,0.87 38.94,1.02 38.79,1.38 38.79,1.42 38.64,1.78 38.28,1.93 32.96,1.93 32.42,2.15 32.2,2.69
VSC on Bottom Layer: 46.92,5.19 47.28,5.04 47.43,4.68 47.43,1.38 47.28,1.02 46.92,0.87 39.3,0.87 38.94,1.02 38.79,1.38 38.79,1.42 38.64,1.78 38.28,1.93 32.48,1.93 32.12,2.08 31.97,2.44 31.97,4.68 32.12,5.04 32.48,5.19
VSC on 内层1: 46.92,5.19 47.28,5.04 47.43,4.68 47.43,1.38 47.28,1.02 46.92,0.87 39.3,0.87 38.94,1.02 38.79,1.38 38.79,1.42 38.64,1.78 38.28,1.93 32.48,1.93 32.12,2.08 31.97,2.44 31.97,4.68 32.12,5.04 32.48,5.19
VSA on Top Layer: 46.72,19.3 47.03,18.98 47.03,15.8 46.97,15.51 46.81,15.26 46.59,15.05 46.35,14.88 46.05,14.83 39.26,14.83 38.9,14.97 38.75,15.33 38.75,15.74 38.6,16.1 38.24,16.25 34.59,16.25 34.35,16.3 34.14,16.43 33.81,16.77 33.6,16.91 33.36,16.96 32.89,16.96 32.44,17.15 32.25,17.59 32.25,19.14 32.48,19.68 33.01,19.91 39.25,19.91 39.54,19.85 39.79,19.68 39.95,19.52 40.2,19.35 40.49,19.3

Small or netless copper shapes (teardrops, artwork), in the pictures only: 124 on Top Layer, 55 on Bottom Layer, 32 on 内层1

## Text on the board
Bottom Silkscreen Layer: RX | TX | G | 5V | GND | VCC
Top Layer: 2025-6-18 | 山东工商学院 银河战舰队
Top Silkscreen Layer: STA | G | 5v | P | GND | VCC | A | B | C | 银河远航
